# EAGLE design si446x-dev (EAGLE 9.3.2)
CNAME: PepeTech; CREVISION: 1; DESIGNER: Joao Silva
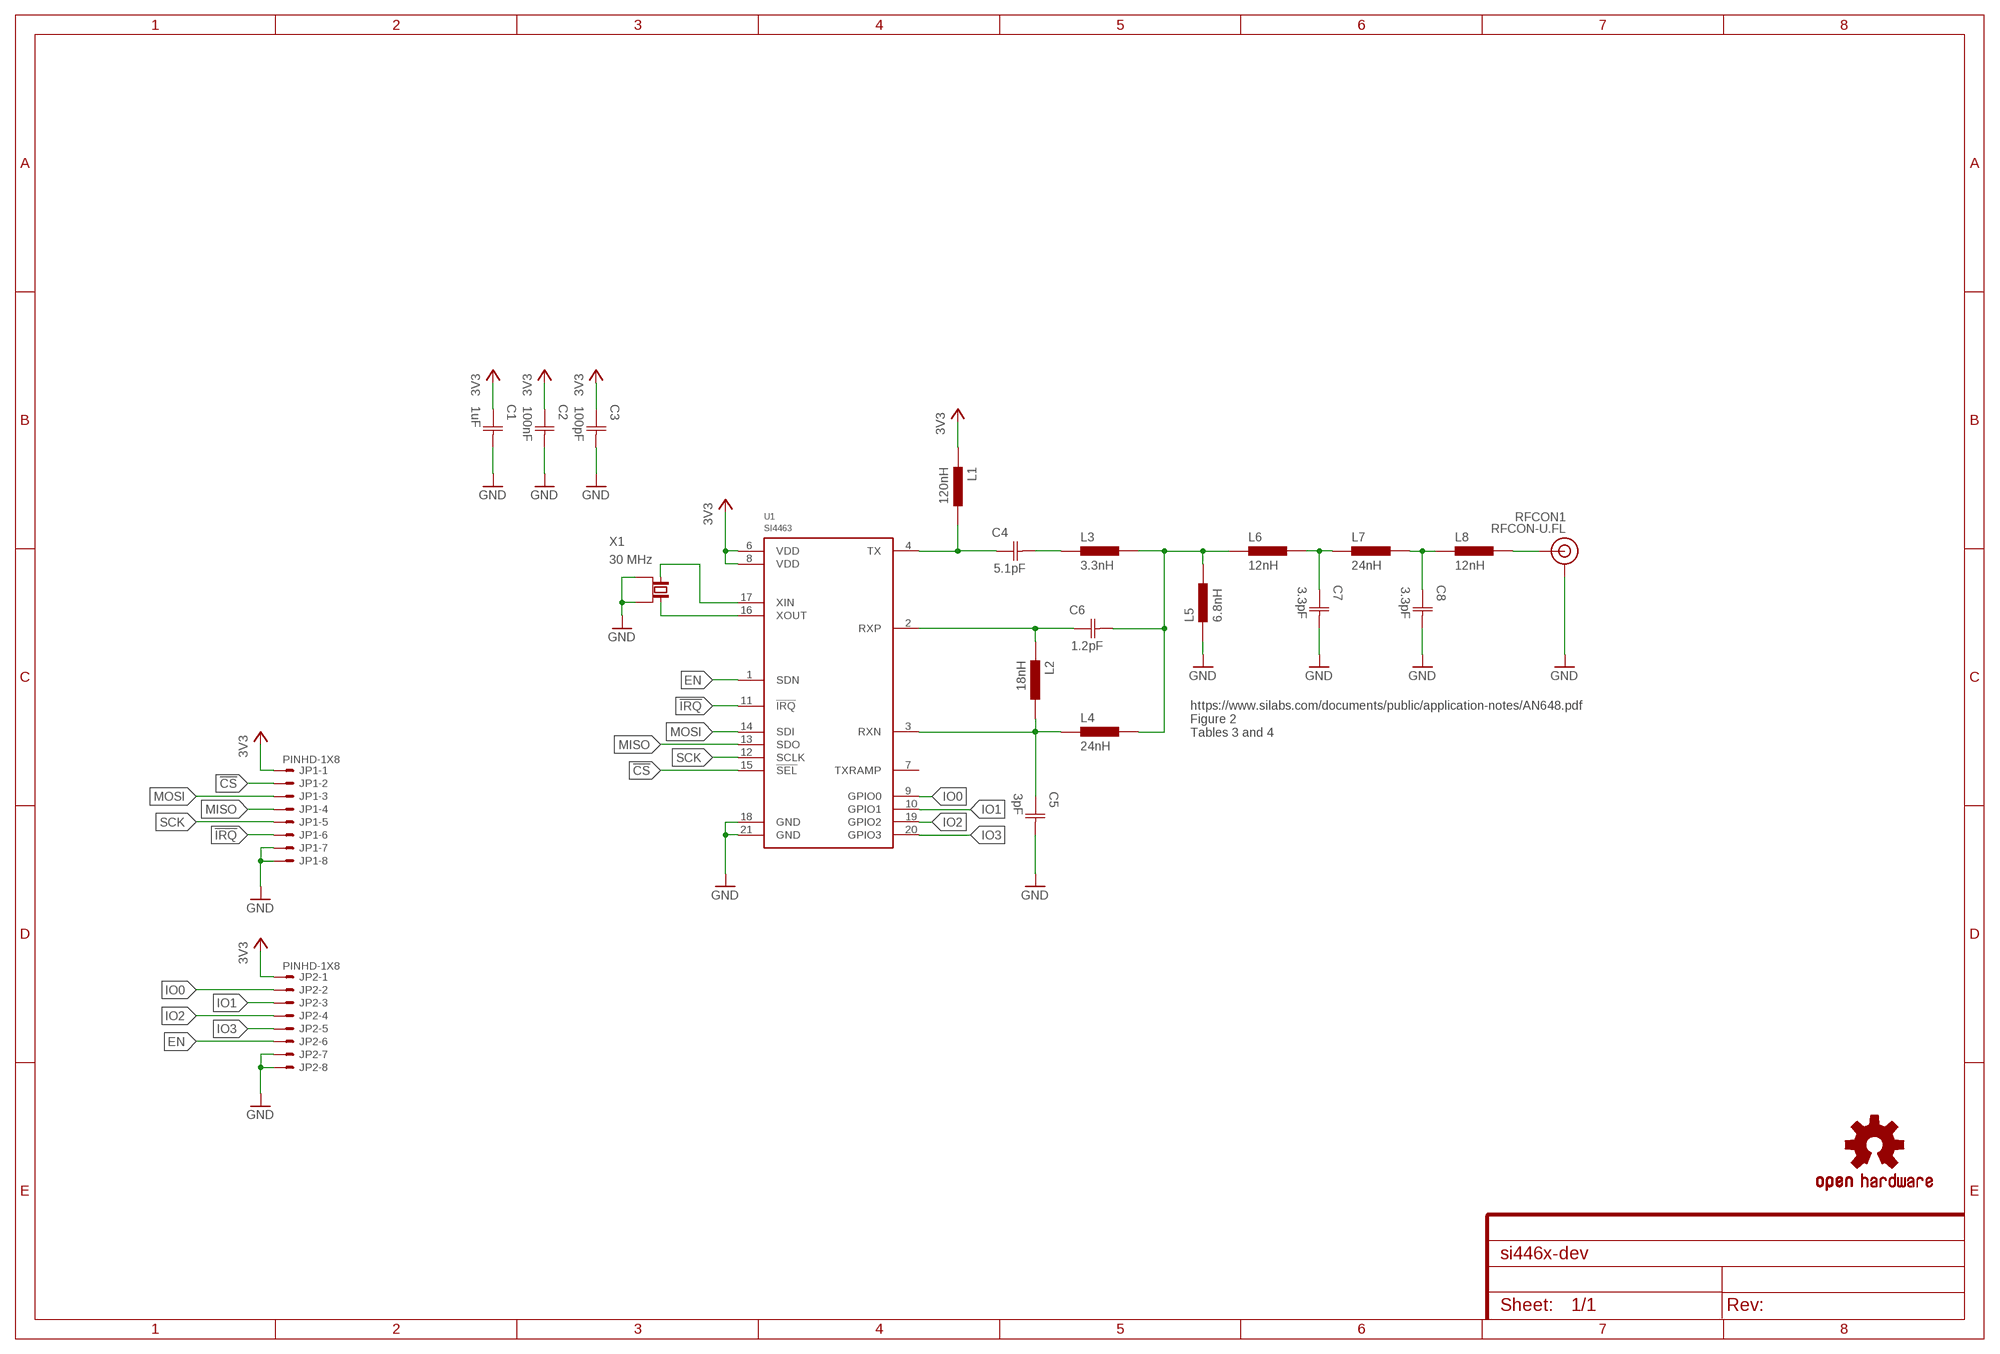
[diagram p0: schematic, sheet 1]

## Parts
C1  1uF  CAPACITOR-0603  [CAP0603]
C2  100nF  CAPACITOR-0603  [CAP0603]
C3  100pF  CAPACITOR-0603  [CAP0603]
C4  5.1pF  CAPACITOR-0603  [CAP0603]
C5  3pF  CAPACITOR-0603  [CAP0603]
C6  1.2pF  CAPACITOR-0603  [CAP0603]
C7  3.3pF  CAPACITOR-0603  [CAP0603]
C8  3.3pF  CAPACITOR-0603  [CAP0603]
JP1  PINHD-1X8  [1X08]
JP2  PINHD-1X8  [1X08]
L1  120nH  INDUCTOR-0603  [IND0603]
L2  18nH  INDUCTOR-0603  [IND0603]
L3  3.3nH  INDUCTOR-0603  [IND0603]
L4  24nH  INDUCTOR-0603  [IND0603]
L5  6.8nH  INDUCTOR-0603  [IND0603]
L6  12nH  INDUCTOR-0603  [IND0603]
L7  24nH  INDUCTOR-0603  [IND0603]
L8  12nH  INDUCTOR-0603  [IND0603]
LOGO1  OSHW-LOGOM  [OSHW-LOGO-M]
RFCON1  RFCON-U.FL  [U.FL]
U1  SI4463  [QFN20]
X1  30 MHz  CRYSTAL_4P  [4-SMD-3225]

## Nets
3V3: C1.1(C1) C2.1(C1) C3.1(C1) JP1.1 JP2.1 L1.1 U1.6(VDD) U1.8(VDD)
!CS: JP1.2 U1.15(!SEL)
!IRQ: JP1.6 U1.11(!IRQ)
EN: JP2.6 U1.1(SDN)
GND: C1.2(C2) C2.2(C2) C3.2(C2) C5.2(C2) C7.2(C2) C8.2(C2) JP1.7 JP1.8 JP2.7 JP2.8 L5.1 RFCON1.P$1(GND) RFCON1.P$2(GND) U1.18(GND) U1.21(GND) X1.2(GND) X1.4(GND)
IO0: JP2.2 U1.9(GPIO0)
IO1: JP2.3 U1.10(GPIO1)
IO2: JP2.4 U1.19(GPIO2)
IO3: JP2.5 U1.20(GPIO3)
MISO: JP1.4 U1.13(SDO)
MOSI: JP1.3 U1.14(SDI)
N$1: C5.1(C1) L2.2 L4.1 U1.3(RXN)
N$2: C6.1(C1) L2.1 U1.2(RXP)
N$3: C6.2(C2) L3.2 L4.2 L5.2 L6.1
N$4: L8.2 RFCON1.P$3(SIGNAL)
N$5: C4.2(C2) L3.1
N$6: C4.1(C1) L1.2 U1.4(TX)
N$7: C7.1(C1) L6.2 L7.1
N$8: C8.1(C1) L7.2 L8.1
N$9: U1.16(XOUT) X1.3
N$10: U1.17(XIN) X1.1
SCK: JP1.5 U1.12(SCLK)
Unconnected: U1.7(TXRAMP)

## Notes on the sheet
- https://www.silabs.com/documents/public/application-notes/AN648.pdf
  Figure 2
  Tables 3 and 4

## Library data of the parts
C1-C8 = Capacitor:CAPACITOR
JP1 JP2 = Pin Header:PINHD-1X8: PIN HEADER
L1-L8 = Inductor:INDUCTOR
LOGO1 = Silkscreen:OSHW-LOGO: Open-Source Hardware (OSHW) Logo This logo indicates the piece of hardware it is found on incorporates a OSHW license and/or adheres to the definition of open source hardware found here: http://freedomdefined.org/OSHW
RFCON1 = RF Connector:RFCON
U1 = Silicon Labs:SI446*
X1 = Crystal:CRYSTAL_4P

## Board
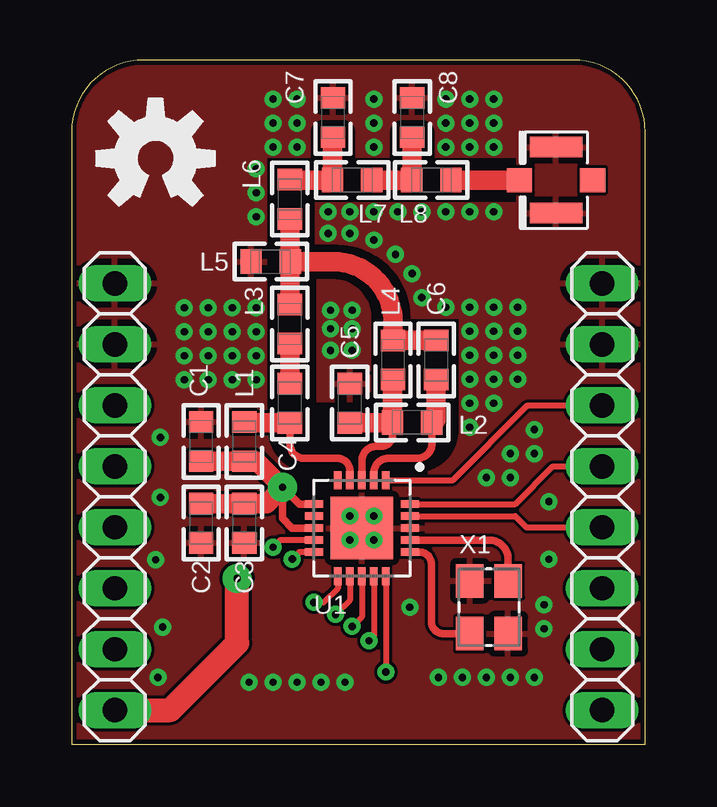
[diagram p1: board, top side]
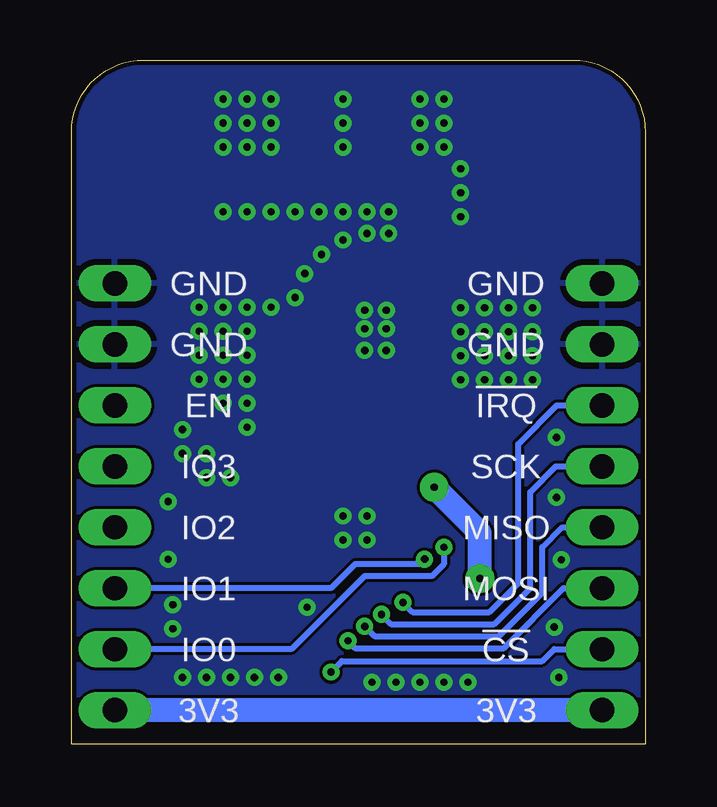
[diagram p2: board, bottom side, seen from below]

Size 23.92 x 28.5 mm. Coordinates in mm from the lower left corner, seen from the top.
Outline: 0,0 23.92,0 23.92,25.5 arc90 20.92,28.5 3,28.5 arc90 0,25.5 0,0
Copper layers (1*16): Top 0.035mm / dielectric 1.6mm / Bottom 0.035mm
Design rules "jlcpcb": minimum track width 5mil, minimum drill 0.3mm, track to track 5mil, track to pad 5mil, pad to pad 5mil, via to via 5mil, smd to smd 5mil, copper to edge 0.2mm, drill to drill 5mil, minimum pad ring 10mil, minimum via ring 8mil, stop-mask expansion 4mil, vias tented up to drill 10mm, thermal gap 10mil
tRestrict: 29 lines

### Footprints (pad centres in the part's own frame; a part is rotated, then mirrored left to right if it is on the bottom)
CAP0603 = smd 0.889 x 1.016: 1 -0.819,0; 2 0.819,0
1X08 = drill 1.016 long: 1 -8.89,0; 2 -6.35,0; 3 -3.81,0; 4 -1.27,0; 5 1.27,0; 6 3.81,0; 7 6.35,0; 8 8.89,0
IND0603 = smd 0.889 x 1.016: 1 -0.819,0; 2 0.819,0
U.FL = smd 2.2 x 0.85: P$1 0,1.375; P$2 0,-1.375 | smd 1.05 x 1: P$3 1.525,0; P$4 -1.525,0
QFN20 = smd 0.75 x 0.3: 1 -2,1; 2 -2,0.5; 3 -2,0; 4 -2,-0.5; 5 -2,-1; 11 2,-1; 12 2,-0.5; 13 2,0; 14 2,0.5; 15 2,1 | smd 0.3 x 0.75: 6 -1,-2; 7 -0.5,-2; 8 0,-2; 9 0.5,-2; 10 1,-2; 16 1,2; 17 0.5,2; 18 0,2; 19 -0.5,2; 20 -1,2 | smd 2.6 x 2.6: 21 0,0
4-SMD-3225 = smd 1.4 x 1.15: 1 -1.1,0.8; 2 1.1,0.8; 3 1.1,-0.8; 4 -1.1,-0.8

### Placement (x,y rotation side)
C1  5.4,12.6 90 top
C2  5.4,9.2 270 top
C3  7.2,9.2 270 top
C4  9.1,14.2 90 top
C5  11.6,14.2 90 top
C6  15.2,16 90 top
C7  10.9,26.1 90 top
C8  14.2,26.1 90 top
JP1  1.8,10.3 90 top
JP2  22.12,10.3 90 top
L1  7.2,12.6 90 top
L2  14.2,13.4 180 top
L3  9.1,17.5 90 top
L4  13.4,16 90 top
L5  8.3,20.1 0 top
L6  9.1,22.7 90 top
L7  11.7,23.5 0 top
L8  15,23.5 0 top
LOGO1  3.5,24.4 0 top
RFCON1  20.2,23.5 180 top
U1  12.1,9 270 top
X1  17.4,5.7 270 top

### Tracks (layer width: path | path; a pad name or v marks a point on that pad's centre or on a via)
3V3  (via drill 0.3 pad 1.2)
  Top 0.305: U1.6 9.5,10 v8.8,10.7 8.8,9.4 9.2,9 U1.8
  Top 0.813: C2.1 C3.1 8.12,10.02 v8.8,10.7 7.72,11.78 L1.1 C1.1
  Top 1: JP1.1 4.11,1.41 6.9,4.2 v6.9,6.9
  Bottom 1: JP1.1 JP2.1 | v6.9,6.9 6.9,8.8 v8.8,10.7
!CS  (via drill 0.3)
  Top 0.254: U1.15 v13.1,3
  Bottom 0.254: v13.1,3 12.65,3.45 4.3,3.45 3.8,3.95 JP1.2
!IRQ  (via drill 0.3)
  Top 0.254: v10.1,5.9 10.5,5.9 11.1,6.5 U1.11
  Bottom 0.254: v10.1,5.9 9.7,5.5 6.5,5.5 5.3,6.7 5.3,12.5 3.69,14.11 JP1.6
EN
  Top 0.254: U1.1 15.9,11 19.01,14.11 JP2.6
GND  (via drill 0.3)
  Top 0.813: U1.21 v11.6,8.5
  other vias: 10.8,18.07 10.8,17.3 11.7,17.3 11.7,16.4 10.8,16.4 11.7,18.07 11.6,9.5 12.6,9.5 12.6,8.5 12.6,21 13.5,20.4 14.2,19.6 10.7,22.17 11.6,22.17 10.7,21.27 11.6,21.27 18.6,18.2 17.6,17.2 18.6,16.2 18.6,15.2 17.6,15.2 17.6,16.2 16.6,16.2 16.6,15.2 16.6,14.2 16.6,13.2 17.6,14.2 18.6,17.2 17.6,18.2 16.6,18.2 16.6,17.2 15.6,18.2 14.6,18.6 17.6,22.17 16.6,22.17 15.6,22.17 14.6,22.17 13.6,22.17 12.6,22.17 17.3,11.1 18.3,11.1 18.3,12.1 19.3,12.1 19.3,13.1 17.6,24.87 16.6,24.87 15.6,24.87 12.6,24.87 9.4,24.87 8.4,24.87 7.7,23.97 7.7,22.97 7.7,21.97 7.7,18.17 7.7,17.17 7.7,16.17 7.7,15.17 19.9,10.1 19.9,7.7 19.3,2.77 18.3,2.77 17.3,2.77 16.3,2.77 15.3,2.77 11.4,2.57 10.4,2.57 9.4,2.57 8.4,2.57 7.4,2.57 3.6,2.77 3.7,12.77 3.7,10.27 3.5,7.67 3.8,4.87 4.7,18.17 4.7,17.17 4.7,16.17 4.7,15.17 5.7,18.17 5.7,17.17 5.7,16.17 5.7,15.17 6.7,18.17 6.7,17.17 6.7,16.17 6.7,15.17 9.4,26.87 8.4,26.87 9.4,25.87 8.4,25.87 12.6,25.87 12.6,26.87 17.6,26.87 16.6,26.87 15.6,26.87 17.6,25.87 16.6,25.87 15.6,25.87 19.7,4.8 19.7,5.8 14.1,5.7
  pour Top (rank 6): -2.3,29.9 25.8,29.9 25.8,-0.8 -2.3,-0.8
  pour Bottom (rank 6): -2.8,30.4 26.2,30.4 26.2,-1.1 -2.8,-1.1
IO0  (via drill 0.3)
  Top 0.254: U1.9 8.7,8.5 v8.4,8.2
  Bottom 0.254: v8.4,8.2 8.4,7.5 8.9,7 11.7,7 14.75,3.95 JP2.2
IO1  (via drill 0.3)
  Top 0.254: U1.10 9.5,8 v9.21,7.71 v9.2,7.71
  Bottom 0.254: v9.2,7.71 9.4,7.51 12.09,7.51 13.11,6.49 JP2.3
IO2
  Top 0.254: U1.19 18.5,9.5 18.97,9.03 JP2.4
IO3
  Top 0.254: U1.20 18.5,10 20.07,11.57 JP2.5
MISO  (via drill 0.3)
  Top 0.254: U1.13 12.1,5.3 v11.7,4.9
  Bottom 0.254: v11.7,4.9 11.3,4.5 6.1,4.5 4.3,6.3 4.3,8.2 3.47,9.03 JP1.4
MOSI  (via drill 0.3)
  Top 0.254: U1.14 12.6,4.5 v12.4,4.3
  Bottom 0.254: v12.4,4.3 12.1,4 5.9,4 3.41,6.49 JP1.3
N$1
  Top 0.305: U1.3 12.1,11.8 arc-90 12.7,12.4 12.9,12.4 arc90 13.38,12.88 L2.2
  Top 0.813: C5.1 13.36,13.38 arc90 L2.2 13.38,15.16 arc-90 L4.1
N$2
  Top 0.305: U1.2 12.6,11.3 arc-90 13.2,11.9 14.42,11.9 arc90 15.02,12.5 L2.1
  Top 0.813: L2.1 arc90 15.2,13.58 C6.1
N$3
  Top 0.813: C6.2 L4.2 13.4,17.6 arc90 10.9,20.1 L5.2 arc90 9.1,20.08 | L3.2 9.1,20.08 | L6.1 9.1,20.08
N$4
  Top 0.813: L8.2 RFCON1.P$3
N$5
  Top 0.813: C4.2 L3.1
N$6
  Top 0.305: U1.4 11.6,11.4 arc90 11.1,11.9 9.7,11.9 arc-90 9.1,12.5 C4.1
  Top 0.813: L1.2 7.24,13.38 C4.1
N$7
  Top 0.813: L6.2 arc90 9.12,23.5 L7.1 10.88,25.26 arc-90 C7.1
N$8
  Top 0.813: L7.2 L8.1 arc90 14.2,23.52 C8.1
N$9
  Top 0.305: X1.3 15.5,4.6 arc-90 15,5.1 15,7.5 arc90 14.5,8 U1.16
N$10
  Top 0.305: U1.17 17.4,8.5 arc-90 18.2,7.7 X1.1
SCK  (via drill 0.3)
  Top 0.254: U1.12 11.6,6 v11,5.4
  Bottom 0.254: v11,5.4 10.6,5 6.3,5 4.8,6.5 4.8,10.5 3.73,11.57 JP1.5

### Text on the board
bPlace: GND / GND / !IRQ! / SCK / MISO / MOSI / !CS! / 3V3 | GND / GND / EN / IO3 / IO2 / IO1 / IO0 / 3V3